# EAGLE design dimmer (EAGLE 7.3.0)
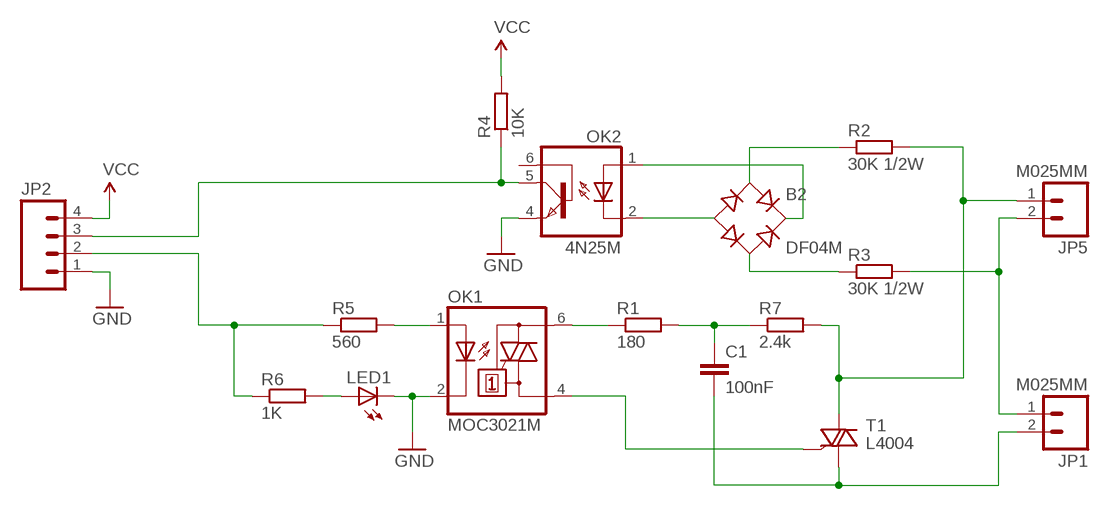
[diagram p0: schematic, sheet 1]

## Parts
B2  DF04M  B-DIL  [B-DIL]
C1  100nF  C-EU050-025X075  [C050-025X075]
JP1  M025MM  [SCREWTERMINAL-5MM-2]
JP2  M04LOCK  [1X04_LOCK]
JP5  M025MM  [SCREWTERMINAL-5MM-2]
LED1  LED5MM  [LED5MM]
OK1  MOC3021M  [DIL06]
OK2  4N25M  [DIL06]
R1  180  R-EU_0309/12  [0309/12]
R2  30K 1/2W  R-EU_0309/12  [0309/12]
R3  30K 1/2W  R-EU_0309/12  [0309/12]
R4  10K  R-EU_0207/2V  [0207/2V]
R5  560  R-EU_0207/2V  [0207/2V]
R6  1K  R-EU_0207/2V  [0207/2V]
R7  2.4k  R-EU_0309/12  [0309/12]
T1  L4004  BT136  [TO220AB]

## Nets
GND: JP2.1 LED1.K(C) OK1.2(C) OK2.4(EMI)
N$1: B2.+ OK2.1(A)
N$2: B2.- OK2.2(C)
N$3: B2.AC1 R2.1
N$4: B2.AC2 R3.1
N$5: C1.1 R1.2 R7.1
N$6: OK1.6(A2) R1.1
N$8: JP5.1 R2.2 R7.2 T1.2(A2)
N$9: JP1.1 JP5.2 R3.2
N$10: C1.2 JP1.2 T1.1(A1)
N$11: JP2.3 OK2.5(COL) R4.1
N$14: JP2.2 R5.1 R6.1
N$15: OK1.1(A) R5.2
N$16: LED1.A R6.2
N$17: OK1.4(A1) T1.3(G)
VCC: JP2.4 R4.2
Unconnected: OK2.6(BAS)

## Library data of the parts
B2 = rectifier:B-DIL: RECTIFIER
C1 = rcl:C-EU: CAPACITOR, European symbol
JP1 JP5 = SparkFun-Connectors:M02: Standard 2-pin 0.1" header. Use with - straight break away headers ( PRT-00116) - right angle break away headers (PRT-00553) - swiss pins (PRT-00743) - machine pins (PRT-00117) - female headers (PRT-00115) Molex polarized connector foot print use with: PRT-08233 with associated crimp pins and housings. 2.54_SCREWTERM for use with PRT-10571. 3.5mm Screw Terminal footprints for PRT-08084 5mm Screw Terminal footprints for use with PRT-08433
JP2 = SparkFun-Connectors:M04: Header 4 Standard 4-pin 0.1" header. Use with straight break away headers (SKU : PRT-00116), right angle break away headers (PRT-00553), swiss pins (PRT-00743), machine pins (PRT-00117), and female headers (PRT-00115). Molex polarized connector foot print use with SKU : PRT-08231 with associated crimp pins and housings. 1MM SMD Version SKU: PRT-10208
LED1 = led:LED: LED OSRAM: - CHIPLED LG R971, LG N971, LY N971, LG Q971, LY Q971, LO R971, LY R971 LH N974, LH R974 LS Q976, LO Q976, LY Q976 LO Q996 - Hyper CHIPLED LW Q18S LB Q993, LB Q99A, LB R99A - SideLED LS A670, LO A670, LY A670, LG A670, LP A670 LB A673, LV A673, LT A673, LW A673 LH A674 LY A675 LS A676, LA A676, LO A676, LY A676, LW A676 LS A679, LY A679, LG A679 - Hyper Micro SIDELED® LS Y876, LA Y876, LO Y876, LY Y876 LT Y87S - SmartLED LW L88C, LW L88S LB L89C, LB L89S, LG L890 LS L89K, LO L89K, LY L89K LS L896, LA L896, LO L896, LY L896 - TOPLED LS T670, LO T670, LY T670, LG T670, LP T670 LSG T670, LSP T670, LSY T670, LOP T670, LYG T670 LG T671, LOG T671, LSG T671 LB T673, LV T673, LT T673, LW T673 LH T674 LS T676, LA T676, LO T676, LY T676, LB T676, LH T676, LSB T676, LW T676 LB T67C, LV T67C, LT T67C, LS T67K, LO T67K, LY T67K, LW E67C LS E67B, LA E67B, LO E67B, LY E67B, LB E67C, LV E67C, LT E67C LW T67C LS T679, LY T679, LG T679 LS T770, LO T770, LY T770, LG T770, LP T770 LB T773, LV T773, LT T773, LW T773 LH T774 LS E675, LA E675, LY E675, LS T675 LS T776, LA T776, LO T776, LY T776, LB T776 LHGB T686 LT T68C, LB T68C - Hyper Mini TOPLED® LB M676 - Mini TOPLED Santana® LG M470 LS M47K, LO M47K, LY M47K Source: http://www.osram.convergy.de LUXEON: - LUMILED® LXK2-PW12-R00, LXK2-PW12-S00, LXK2-PW14-U00, LXK2-PW14-V00 LXK2-PM12-R00, LXK2-PM12-S00, LXK2-PM14-U00 LXK2-PE12-Q00, LXK2-PE12-R00, LXK2-PE12-S00, LXK2-PE14-T00, LXK2-PE14-U00 LXK2-PB12-K00, LXK2-PB12-L00, LXK2-PB12-M00, LXK2-PB14-N00, LXK2-PB14-P00, LXK2-PB14-Q00 LXK2-PR12-L00, LXK2-PR12-M00, LXK2-PR14-Q00, LXK2-PR14-R00 LXK2-PD12-Q00, LXK2-PD12-R00, LXK2-PD12-S00 LXK2-PH12-R00, LXK2-PH12-S00 LXK2-PL12-P00, LXK2-PL12-Q00, LXK2-PL12-R00 Source: www.luxeon.com KINGBRIGHT: KA-3528ASYC Source: www.kingbright.com
OK1 = optocoupler:MOC30*M: RANDOM-PHASE OPTOISOLATORS TRIAC DRIVER OUTPUT Source: http://www.fairchildsemi.com MOC3020-M.pdf; MF: FAIRCHILD SEMICONDUCTOR; MPN: MOC3021-M; OC_FARNELL: 1021365; OC_NEWARK: 95B7895
OK2 = optocoupler:4N*?M: General Purpose 6-Pin Phototransistor Optocouplers Source: http://www.fairchildsemi.com/ds/4N/4N35-M.pdf; MPN: 4N25-M; OC_FARNELL: 1021349; OC_NEWARK: 98K9084
R1-R7 = resistor:R-EU_: RESISTOR, European symbol
T1 = triac:BT136: Triac BT136 series E sensitive gate Source: http://www.nxp.com/acrobat_download/datasheets/BT136_SERIES_E_2.pdf

## Board
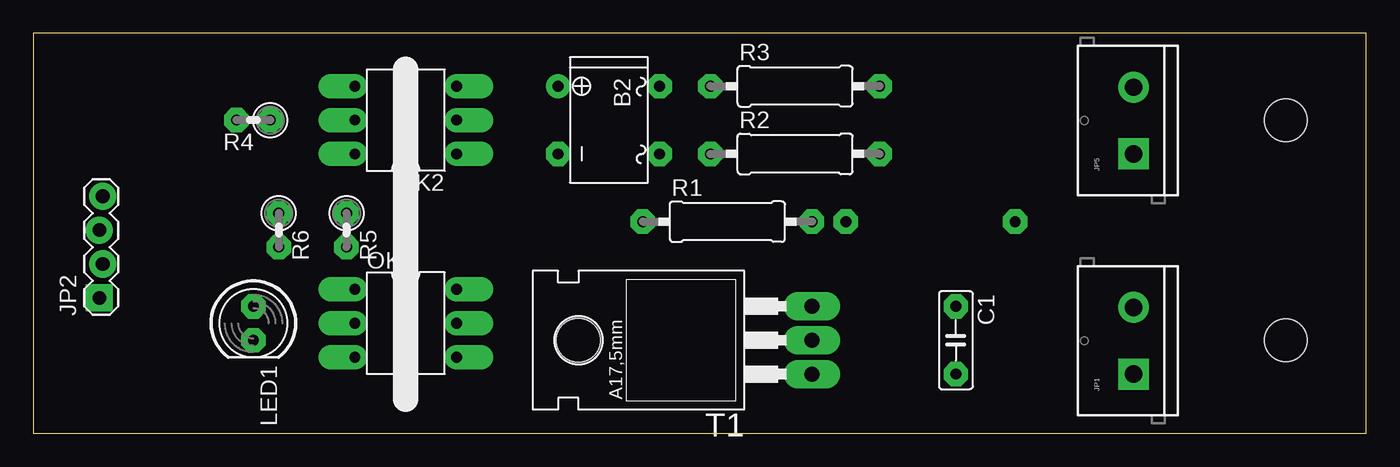
[diagram p1: board, top side]
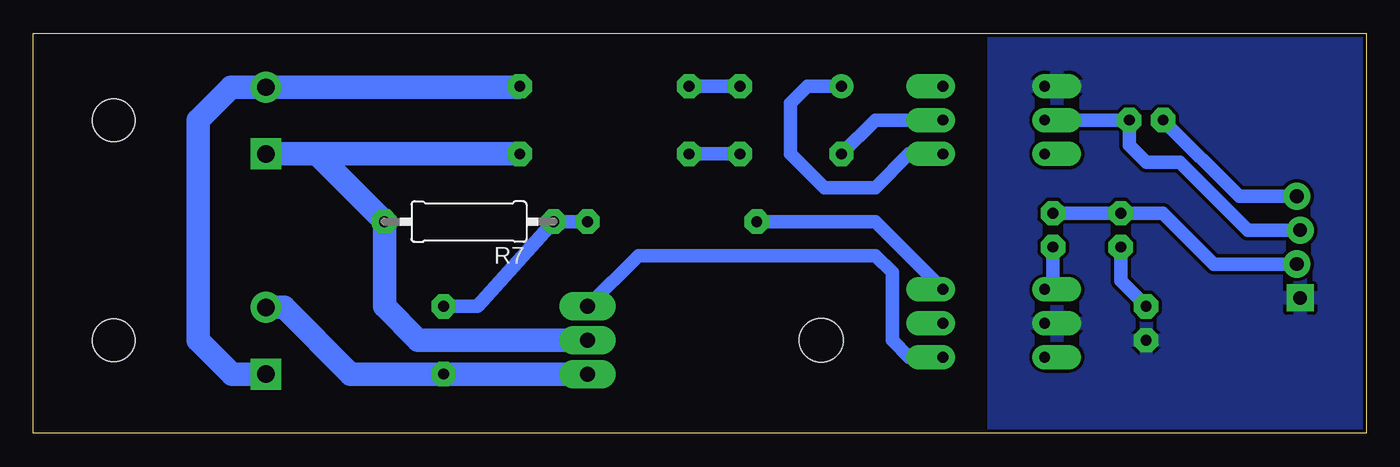
[diagram p2: board, bottom side, seen from below]

Size 100 x 30 mm. Coordinates in mm from the lower left corner, seen from the top.
Outline: 0,0 100,0 100,30 0,30 0,0
Copper layers (1*16): Top 0.0356mm / dielectric 1.5011mm / Bottom 0.0356mm
Design rules "diy_board *": minimum track width 16mil, minimum drill 30mil, track to track 10mil, track to pad 10mil, pad to pad 10mil, via to via 10mil, smd to smd 10mil, copper to edge 10mil, drill to drill 10mil, minimum pad ring 20mil, minimum via ring 20mil, stop-mask expansion 3mil, vias tented up to drill 0mil, thermal gap 10mil
Holes 3.2 mm at 93.98,23.5 93.98,6.99

### Footprints (pad centres in the part's own frame; a part is rotated, then mirrored left to right if it is on the bottom)
B-DIL = drill 0.813: + -2.54,-3.81 | drill 0.813 octagon: - 2.54,-3.81; AC1 2.54,3.81; AC2 -2.54,3.81
C050-025X075 = drill 0.813 octagon: 1 -2.54,0; 2 2.54,0
SCREWTERMINAL-5MM-2 = drill 1.3 pad 2.032 square: 1 0,0 | drill 1.3 pad 2.032: 2 5,0
1X04_LOCK = drill 1.016 pad 1.88 square: 1 0,0.127 | drill 1.016 pad 1.88: 2 2.54,-0.127; 3 5.08,0.127; 4 7.62,-0.127
LED5MM = drill 0.813 octagon: A -1.27,0; K 1.27,0
DIL06 = drill 0.813 offset: 1 -2.54,-3.81; 2 0,-3.81; 3 2.54,-3.81; 4 2.54,3.81; 5 0,3.81; 6 -2.54,3.81
0309/12 = drill 0.813 octagon: 1 -6.35,0; 2 6.35,0
0207/2V = drill 0.813 octagon: 1 -1.27,0; 2 1.27,0
TO220AB = drill 1.118 long: 1 -2.54,-6.35; 2 0,-6.35; 3 2.54,-6.35 | hole 3.302: 0,11.176

### Placement (x,y rotation side)
B2  43.18,23.5 270 top
C1  69.22,6.99 270 top
JP1  82.55,4.45 90 top
JP2  5.08,10.16 90 top
JP5  82.55,20.95 90 top
LED1  16.51,8.26 270 top
OK1  27.94,8.26 270 top
OK2  27.94,23.5 90 top
R1  52.07,15.88 0 top
R2  57.15,20.95 0 top
R3  57.15,26.04 0 top
R4  16.51,23.5 180 top
R5  23.5,15.24 270 top
R6  18.41,15.24 270 top
R7  67.31,15.88 180 bottom
T1  52.07,6.99 90 top

### Tracks (layer width: path | path; a pad name or v marks a point on that pad's centre or on a via)
GND
  pour Bottom: 0,30.48 0,0 27.94,0 27.94,30.48
N$1
  Bottom 1.016: B2.+ 41.91,26.04 43.18,24.77 43.18,20.95 40.64,18.41 36.83,18.41 34.29,20.95 OK2.1
N$2
  Bottom 1.016: B2.- 36.83,23.5 OK2.2
N$3
  Bottom 1.016: B2.AC1 R2.1
N$4
  Bottom 1.016: R3.1 B2.AC2
N$5
  Bottom 1.016: R1.2 R7.1 66.67,9.53 C1.1
N$6
  Bottom 1.016: OK1.6 36.83,15.88 R1.1
N$8
  Bottom 1.778: 78.74,20.95 R2.2 | T1.2 71.12,6.99 73.66,9.53 R7.2 78.74,20.95 | 78.74,20.95 JP5.1
N$9
  Bottom 1.778: JP1.1 85.09,4.45 87.63,6.99 87.63,23.5 85.17,25.95 JP5.2 63.58,25.95 R3.2
N$10
  Bottom 1.778: T1.1 C1.2 76.2,4.45 81.2,9.45 JP1.2
N$11
  Bottom 1.016: OK2.5 R4.1 17.78,21.59 16.51,20.32 13.97,20.32 8.89,15.24 JP2.3
N$14
  Bottom 1.016: R5.1 R6.1 15.24,16.51 11.43,12.7 JP2.2
N$15
  Bottom 1.016: R5.2 23.5,11.43 OK1.1
N$16
  Bottom 1.016: R6.2 18.41,11.43 LED1.A
N$17
  Bottom 1.016: T1.3 54.61,13.34 36.83,13.34 35.56,12.06 35.56,6.99 34.29,5.71 OK1.4
VCC
  Bottom 1.016: JP2.4 9.53,17.78 R4.2